# EAGLE design EBus2Lan-Adapter-1.0 (EAGLE 5.10)
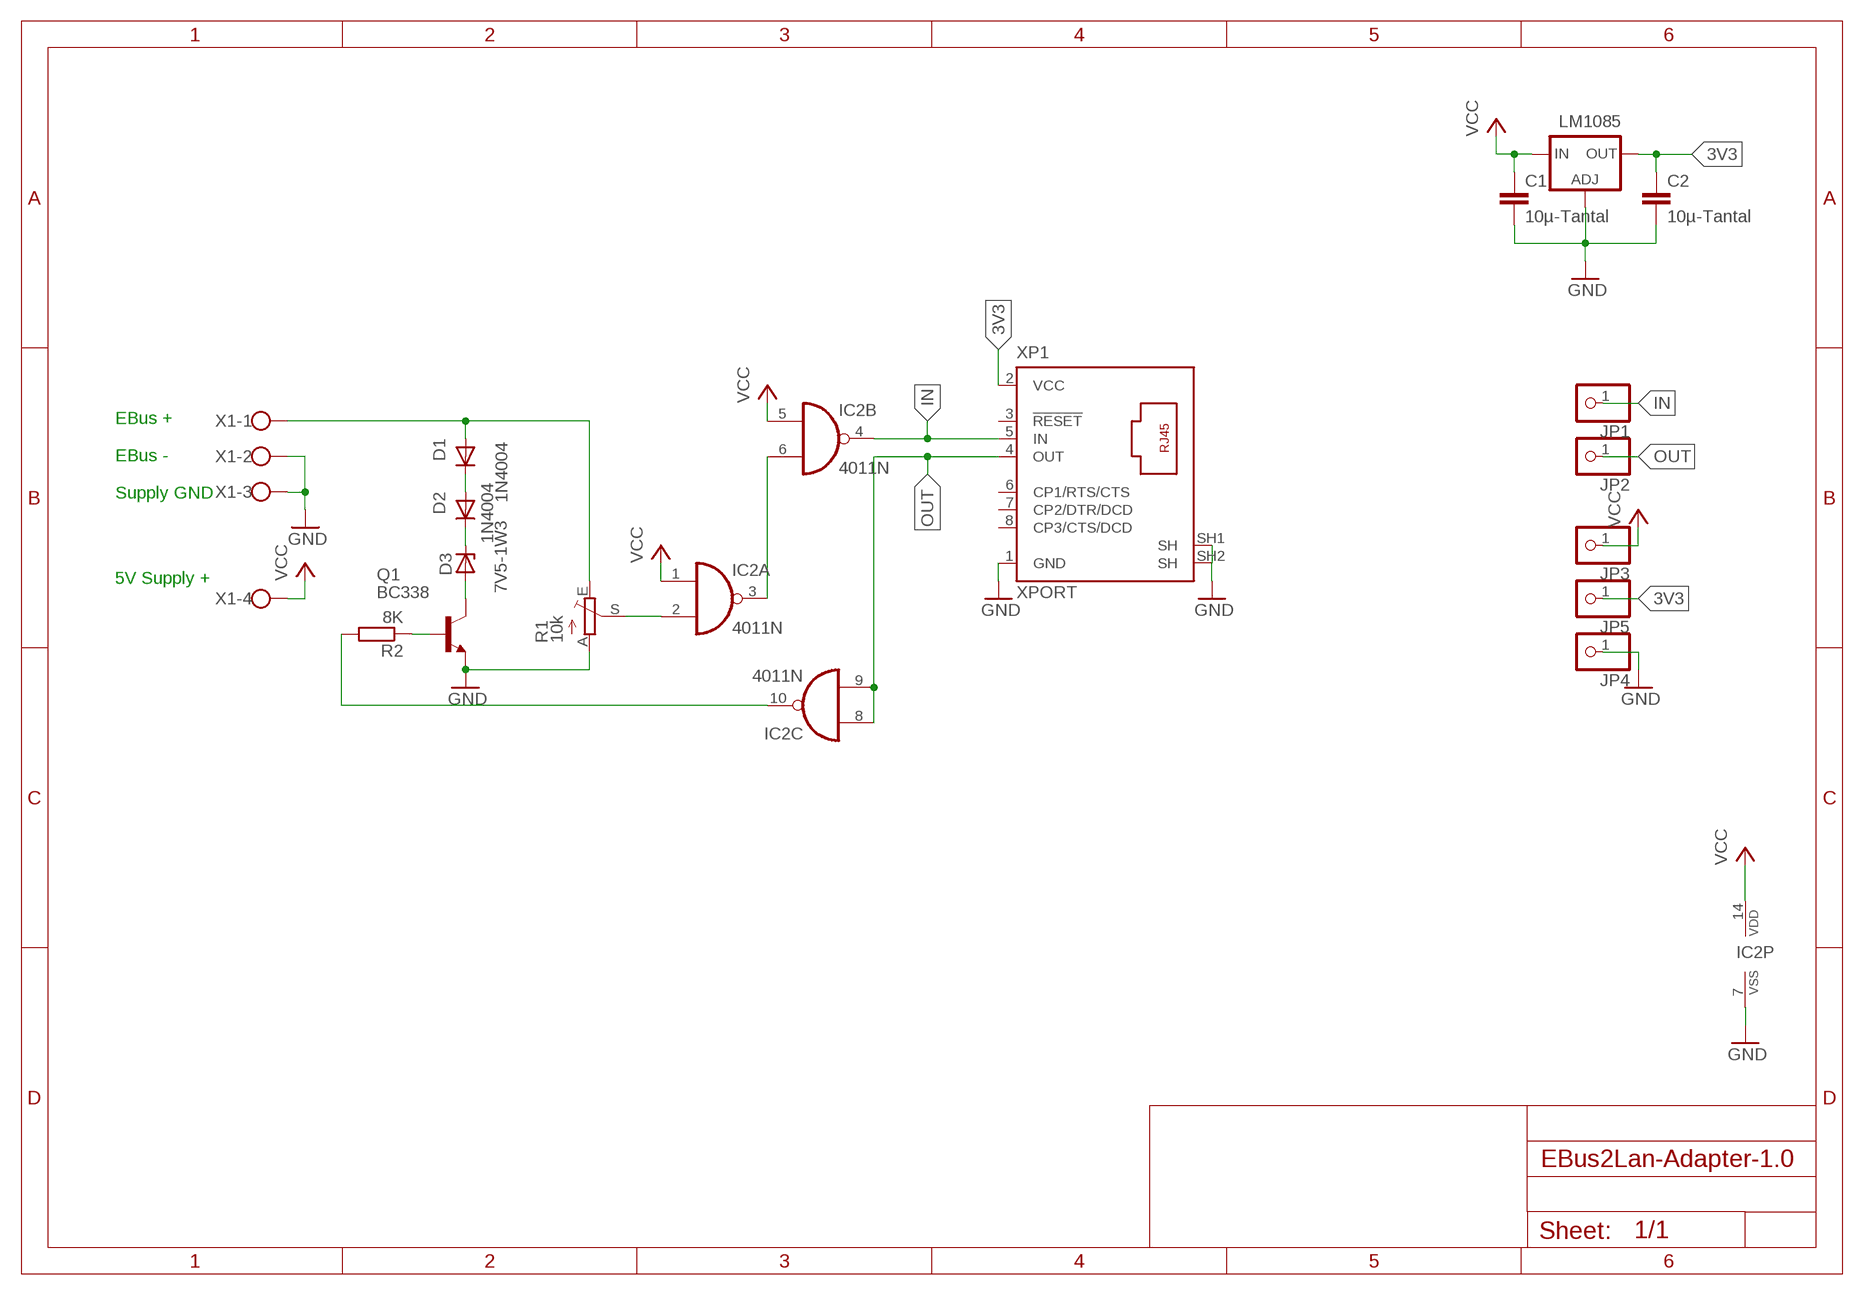
[diagram p0: schematic, sheet 1]

## Parts
C1  10µ-Tantal  C2.5/5  [C2.5-5]
C2  10µ-Tantal  C2.5/5  [C2.5-5]
D1  1N4004  [DO41-10]
D2  1N4004  [DO41-10]
D3  7V5-1W3  1N5333  [C1702-15]
IC2  4011N  [DIL14]
JP1  PINHD-1X1  [1X01]
JP2  PINHD-1X1  [1X01]
JP3  PINHD-1X1  [1X01]
JP4  PINHD-1X1  [1X01]
JP5  PINHD-1X1  [1X01]
LM1085  LM317TS  [317TS]
Q1  BC338  [TO92-EBC]
R1  10k  TRIM_EU-LI10  [LI10]
R2  8K  R-EU_0309/V  [0309V]
X1  W237-04P  [W237-4P]
XP1  XPORT  [XPORT]

## Nets
3V3: C2.1 JP5.1 LM1085.2(OUT) XP1.2(VCC)
GND: C1.2 C2.2 IC2.7(P:VSS) JP4.1 LM1085.1(ADJ) Q1.E R1.A X1.2 X1.3 XP1.1(GND) XP1.SH1(SH) XP1.SH2(SH)
IN: IC2.4(B:O) JP1.1 XP1.5(IN)
N$1: D1.C D2.A
N$2: IC2.3(A:O) IC2.6(B:I1)
N$6: IC2.2(A:I1) R1.S
N$7: D1.A R1.E X1.1
N$8: Q1.B R2.1
N$9: IC2.10(C:O) R2.2
N$11: D3.A Q1.C
N$12: D2.C D3.C
OUT: IC2.8(C:I0) IC2.9(C:I1) JP2.1 XP1.4(OUT)
VCC: C1.1 IC2.1(A:I0) IC2.5(B:I0) IC2.14(P:VDD) JP3.1 LM1085.3(IN) X1.4
Unconnected: IC2.11(D:O) IC2.12(D:I0) IC2.13(D:I1) XP1.3(!RESET) XP1.6(CP1/RTS/CTS) XP1.7(CP2/DTR/DCD) XP1.8(CP3/CTS/DCD)

## Notes on the sheet
- EBus +
- EBus -
- Supply GND
- 5V Supply +

## Library data of the parts
C1 C2 = capacitor-wima:C: CAPACITOR naming: grid - package width
D1 D2 = diode:1N4004: DIODE general purpose rectifier, 1 A
D3 = diode:1N5333: Z DIODE 3.3 V, 5W, 5 percent (Motorola)
IC2 = 40xx:4011: Quad 2-input NAND
JP1-JP5 = pinhead:PINHD-1X1: PIN HEADER
LM1085 = v-reg:LM317TS: VOLTAGE REGULATOR
Q1 = transistor-npn:BC338*: NPN Transistor
R1 = pot:TRIM_EU-: POTENTIOMETER
R2 = rcl:R-EU_: RESISTOR, European symbol
X1 = con-wago-508:W237-04P: WAGO SREW CLAMP
XP1 = lantronix:XPORT: Serial to 10/100 Ethernet transceiver Source: http://www.lantronix.com/pdf/XPort_DS.pdf

## Board
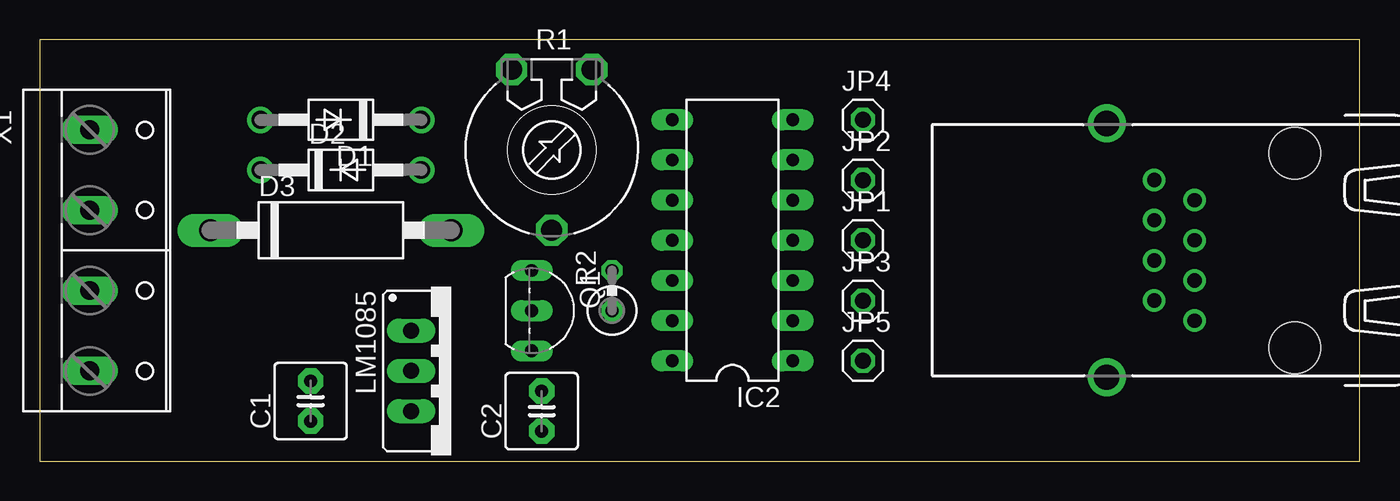
[diagram p1: board, top side]
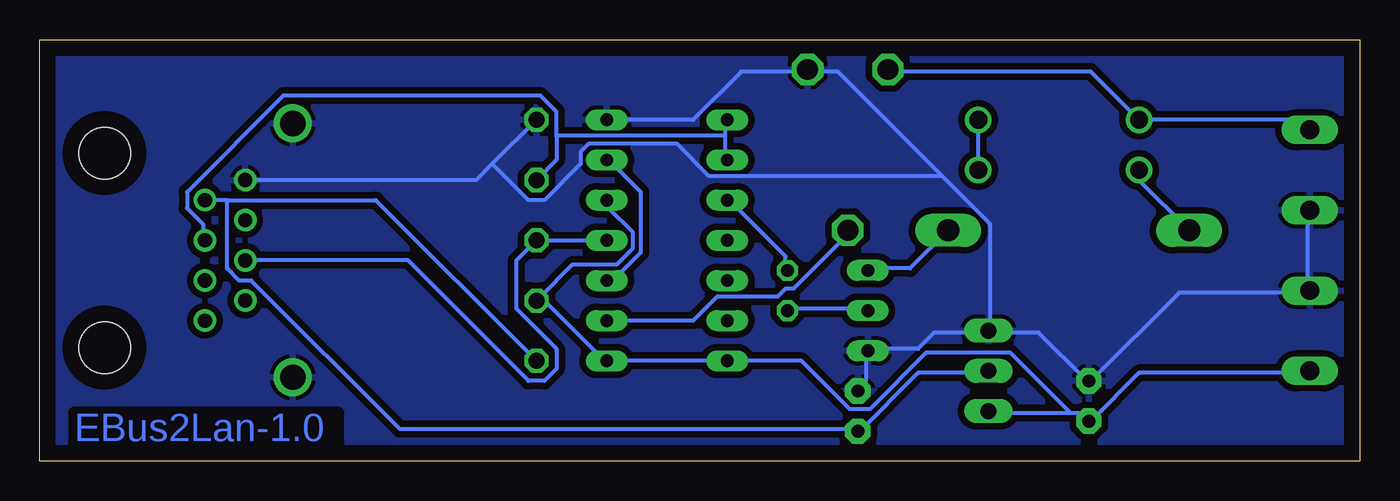
[diagram p2: board, bottom side, seen from below]

Size 83.49 x 26.66 mm. Coordinates in mm from the lower left corner, seen from the top.
Outline: 0,0 83.49,0 83.49,26.66 0,26.66 0,0
Copper layers (1*16): Top 0.035mm / dielectric 1.5mm / Bottom 0.035mm
Design rules "default": minimum track width 10mil, minimum drill 24mil, track to track 8mil, track to pad 8mil, pad to pad 8mil, via to via 8mil, smd to smd 8mil, copper to edge 40mil, drill to drill 8mil, minimum pad ring 10mil, minimum via ring 8mil, stop-mask expansion 4mil, vias tented up to drill 0mil, thermal gap 10mil

### Footprints (pad centres in the part's own frame; a part is rotated, then mirrored left to right if it is on the bottom)
C2.5-5 = drill 0.813 pad 1.6 octagon: 1 -1.27,0; 2 1.27,0
DO41-10 = drill 1.118 round: A 5.08,0; C -5.08,0
C1702-15 = drill 1.397 long: A 7.62,0; C -7.62,0
DIL14 = drill 0.813 long: 1 -7.62,-3.81; 2 -5.08,-3.81; 3 -2.54,-3.81; 4 0,-3.81; 5 2.54,-3.81; 6 5.08,-3.81; 7 7.62,-3.81; 8 7.62,3.81; 9 5.08,3.81; 10 2.54,3.81; 11 0,3.81; 12 -2.54,3.81; 13 -5.08,3.81; 14 -7.62,3.81
1X01 = drill 1.016 octagon: 1 0,0
317TS = drill 1.016 long: 1 -2.54,-2.54; 2 0,-2.54; 3 2.54,-2.54
TO92-EBC = drill 0.813 long: B 0,-1.27; C -2.54,-1.27; E 2.54,-1.27
LI10 = drill 1.321 octagon: A -2.54,-5.08; E 2.54,-5.08; S 0,5.08
0309V = drill 0.813 octagon: 1 -1.27,0; 2 1.27,0
W237-4P = drill 1.194 long: 1 -7.62,-0.635; 2 -2.54,-0.635; 3 2.54,-0.635; 4 7.62,-0.635
XPORT = drill 0.9 pad 1.422 round: 1 1.27,-4.445; 2 -1.27,-3.175; 3 1.27,-1.905; 4 -1.27,-0.635; 5 1.27,0.635; 6 -1.27,1.905; 7 1.27,3.175; 8 -1.27,4.445 | drill 1.6 pad 2.2 round: SH1 4.28,8.025; SH2 4.28,-8.025 | hole 3.25: -7.62,-6.15; -7.62,6.15

### Placement (x,y rotation side)
C1  17.14,3.81 90 top
C2  31.75,3.17 90 top
D1  19.05,21.59 180 top
D2  19.05,18.41 0 top
D3  18.41,14.6 0 top
IC2  43.81,13.97 90 top
JP1  52.07,13.97 0 top
JP2  52.07,17.78 0 top
JP3  52.07,10.16 0 top
JP4  52.07,21.59 0 top
JP5  52.07,6.35 0 top
LM1085  26.04,5.71 270 top
Q1  32.38,9.52 270 top
R1  32.38,19.69 180 top
R2  36.2,10.8 90 top
X1  3.81,13.33 270 top
XP1  71.75,13.33 180 top

### Tracks (layer width: path | path; a pad name or v marks a point on that pad's centre or on a via)
3V3
  Bottom 0.254: LM1085.2 23.62,5.59 27.94,5.59 31.75,1.78 C2.1 31.75,2.03 60.71,2.03 70.1,11.43 70.87,11.43 71.63,12.19 71.63,16.51 | 71.63,16.51 62.23,16.51 JP5.1 | 71.63,16.51 XP1.2
GND
  Bottom 0.254: 54.86,18.8 JP4.1 | 54.86,18.8 55.88,17.78 XP1.1 | IC2.7 42.16,21.59 39.12,24.64 35.05,24.64 R1.A 34.8,24.64 33.02,24.64 26.42,18.03 | X1.2 3.3,15.75 3.3,10.92 X1.3 3.3,10.67 11.43,10.67 17.02,5.08 C1.2 17.27,5.08 20.32,8.13 23.37,8.13 LM1085.1 | C2.2 31.75,4.57 31.24,5.08 31.24,6.86 Q1.E 30.99,7.11 27.94,7.11 26.92,8.13 23.62,8.13 LM1085.1 | 26.42,18.03 23.37,14.99 23.37,8.38 LM1085.1 | 54.86,18.8 52.58,16.51 51.56,16.51 49.28,18.8 49.28,19.56 48.77,20.07 43.18,20.07 41.15,18.03 26.42,18.03
  pour Bottom (isolate 0.406): 0,26.67 83.82,26.67 83.82,0 0,0
IN
  Bottom 0.254: IC2.4 JP1.1 53.34,12.7 53.34,9.65 50.8,7.11 50.8,5.84 51.56,5.08 52.58,5.08 60.2,12.7 XP1.5
N$1
  Bottom 0.254: D2.A D1.C
N$2
  Bottom 0.254: IC2.3 47.5,11.43 46.99,11.94 46.74,11.94 45.47,13.21 45.47,17.02 47.5,19.05 IC2.6
N$6
  Bottom 0.254: IC2.2 42.16,8.89 40.64,10.41 36.83,10.41 36.32,10.92 35.81,10.92 32.26,14.48 R1.S
N$7
  Bottom 0.254: X1.1 3.81,21.59 D1.A 17.02,24.64 29.72,24.64 R1.E
N$8
  Bottom 0.254: Q1.B 31.24,9.65 36.07,9.65 R2.1
N$9
  Bottom 0.254: R2.2 36.32,12.19 36.32,12.95 39.88,16.51 IC2.10
N$11
  Bottom 0.254: Q1.C 30.99,12.19 28.45,12.19 D3.A
N$12
  Bottom 0.254: D2.C 13.97,17.78 D3.C
OUT
  Bottom 0.254: 40.13,20.57 40.13,21.59 IC2.8 | 40.13,20.57 40.13,19.05 IC2.9 | 50.8,20.57 50.8,19.05 JP2.1 | 50.8,20.57 50.8,22.1 51.82,23.11 68.07,23.11 74.17,17.02 74.17,16 73.15,14.99 73.15,13.97 XP1.4 | 40.13,20.57 50.8,20.57
VCC
  Bottom 0.254: 51.82,10.41 49.78,12.45 46.99,12.45 45.97,13.46 45.97,14.48 47.5,16 47.5,16.51 IC2.5 | 51.82,10.41 47.75,6.35 IC2.1 IC2.14 35.31,6.35 32.26,3.3 30.99,3.3 27.43,6.86 22.1,6.86 18.29,3.05 | 51.82,10.41 JP3.1 | 18.29,3.05 17.78,3.05 17.27,2.54 C1.1 17.02,2.54 13.97,5.59 3.3,5.59 X1.4 | 18.29,3.05 23.37,3.05 LM1085.3

### Text on the board
Bottom: EBus2Lan-1.0